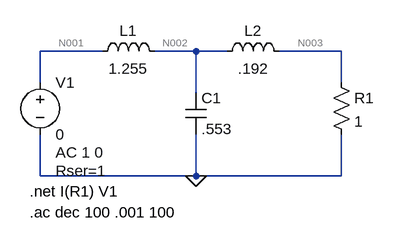
[diagram p0: schematic ts16.asc]
ts16.asc, the LTspice schematic file:
Version 4
SHEET 1 880 680
WIRE 96 64 0 64
WIRE 240 64 176 64
WIRE 288 64 240 64
WIRE 464 64 368 64
WIRE 0 112 0 64
WIRE 464 112 464 64
WIRE 240 128 240 64
WIRE 0 256 0 192
WIRE 240 256 240 192
WIRE 240 256 0 256
WIRE 464 256 464 192
WIRE 464 256 240 256
FLAG 240 256 0
SYMBOL voltage 0 96 R0
WINDOW 123 24 124 Left 2
WINDOW 39 24 152 Left 2
SYMATTR Value2 AC 1 0
SYMATTR SpiceLine Rser=1
SYMATTR InstName V1
SYMATTR Value 0
SYMBOL ind 80 80 R270
WINDOW 0 32 56 VTop 2
WINDOW 3 5 56 VBottom 2
SYMATTR InstName L1
SYMATTR Value 1.255
SYMBOL ind 272 80 R270
WINDOW 0 32 56 VTop 2
WINDOW 3 5 56 VBottom 2
SYMATTR InstName L2
SYMATTR Value .192
SYMBOL cap 224 128 R0
SYMATTR InstName C1
SYMATTR Value .553
SYMBOL res 448 96 R0
SYMATTR InstName R1
SYMATTR Value 1
TEXT -16 280 Left 2 !.net I(R1) V1
TEXT -16 312 Left 2 !.ac dec 100 .001 100

The netlist it stands for:
* ts16.asc
V1 N001 0 0 AC 1 0 Rser=1
L1 N001 N002 1.255
L2 N002 N003 .192
C1 N002 0 .553
R1 N003 0 1
.net I(R1) V1
.ac dec 100 .001 100
.backanno
.end

* Results of the author's LTspice run, read from the files saved beside the schematic
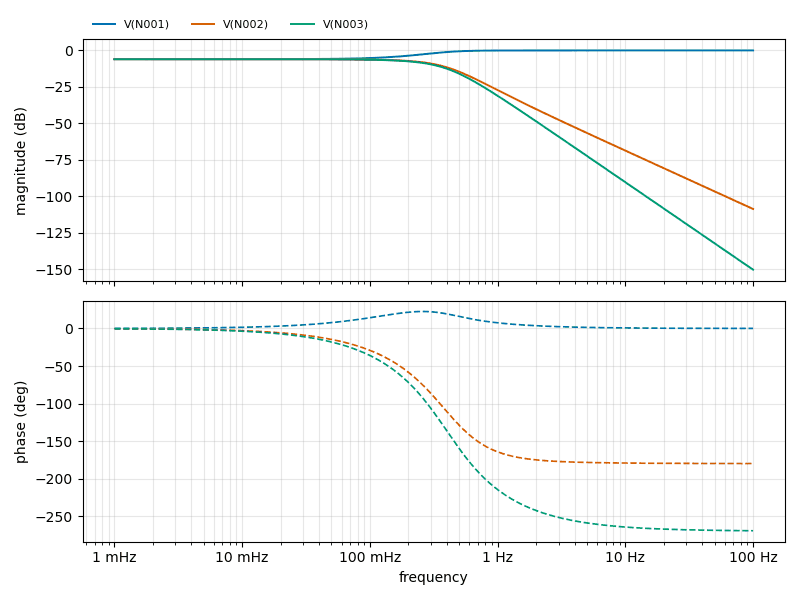
[diagram p1: AC Analysis of ts16.asc, plotted from the saved traces]
* AC Analysis, 1 run:
*   V(N001): -6.01 dB at 1 mHz, -0.00 dB at 100 Hz, peak -0.00 dB at 100 Hz, 3 dB below the peak at 238.5 mHz
*   V(N002): -6.02 dB at 1 mHz, -108.75 dB at 100 Hz, peak -6.02 dB at 1 mHz, 3 dB below the peak at 301.3 mHz
*   V(N003): -6.03 dB at 1 mHz, -150.38 dB at 100 Hz, peak -6.03 dB at 1 mHz, 3 dB below the peak at 279.4 mHz